# Altium schematic sheet InterfacesB_NONISO232a.SchDoc
size A; DocumentNumber: 4; SheetNumber: 4
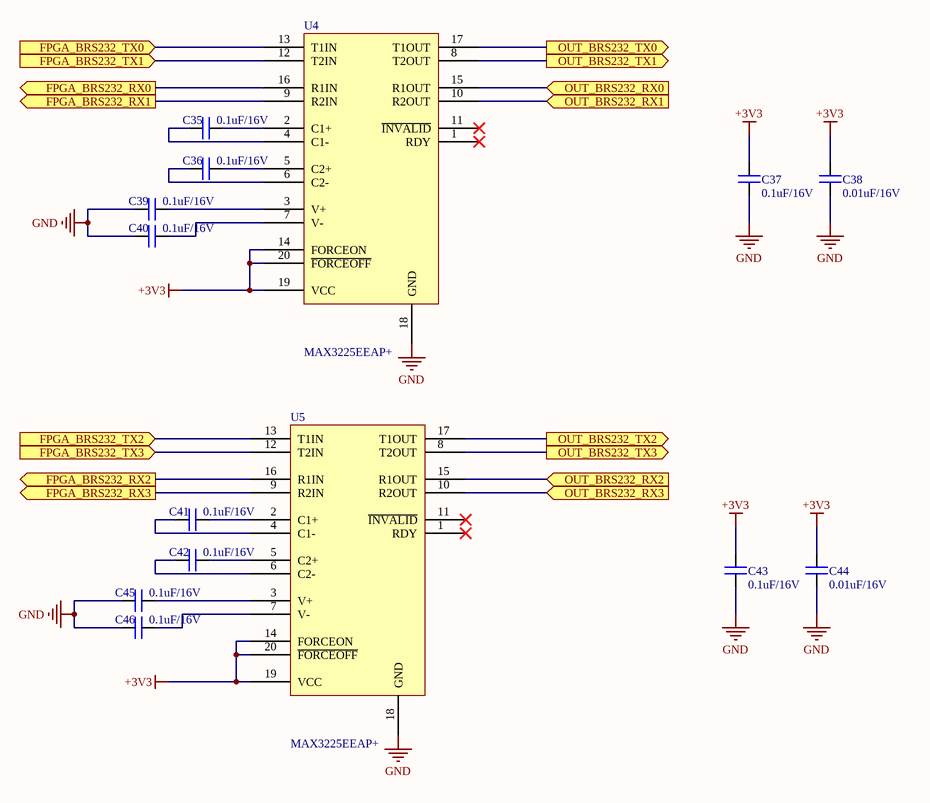
[diagram p0: InterfacesB_NONISO232a.SchDoc]

## Parts
C35  value 0.1uF/16V  [CAP_0805]  (hidden comment: CAP_0805)
C36  value 0.1uF/16V  [CAP_0805]  (hidden comment: CAP_0805)
C37  value 0.1uF/16V  [CAP_0805]  (hidden comment: CAP_0805)
C38  value 0.01uF/16V  [CAP_0805]  (hidden comment: CAP_0805)
C39  value 0.1uF/16V  [CAP_0805]  (hidden comment: CAP_0805)
C40  value 0.1uF/16V  [CAP_0805]  (hidden comment: CAP_0805)
C41  value 0.1uF/16V  [CAP_0805]  (hidden comment: CAP_0805)
C42  value 0.1uF/16V  [CAP_0805]  (hidden comment: CAP_0805)
C43  value 0.1uF/16V  [CAP_0805]  (hidden comment: CAP_0805)
C44  value 0.01uF/16V  [CAP_0805]  (hidden comment: CAP_0805)
C45  value 0.1uF/16V  [CAP_0805]  (hidden comment: CAP_0805)
C46  value 0.1uF/16V  [CAP_0805]  (hidden comment: CAP_0805)
U4  MAX3225EEAP+  [MAX3225EEAP+]
U5  MAX3225EEAP+  [MAX3225EEAP+]

## Ports
FPGA_BRS232_RX0 (out), FPGA_BRS232_RX1 (out), FPGA_BRS232_RX2 (out), FPGA_BRS232_RX3 (out), FPGA_BRS232_TX0 (in), FPGA_BRS232_TX1 (in), FPGA_BRS232_TX2 (in), FPGA_BRS232_TX3 (in), OUT_BRS232_RX0 (in), OUT_BRS232_RX1 (in), OUT_BRS232_RX2 (in), OUT_BRS232_RX3 (in), OUT_BRS232_TX0 (out), OUT_BRS232_TX1 (out), OUT_BRS232_TX2 (out), OUT_BRS232_TX3 (out)

## Nets
+3V3: C37.1 C38.1 C43.1 C44.1 U4.14(FORCEON) U4.19(VCC) U4.20(~{FORCEOFF}) U5.14(FORCEON) U5.19(VCC) U5.20(~{FORCEOFF})
GND: C37.2 C38.2 C39.2 C40.2 C43.2 C44.2 C45.2 C46.2 U4.18(GND) U5.18(GND)
FPGA_BRS232_RX0: U4.16(R1IN) ; port FPGA_BRS232_RX0
FPGA_BRS232_RX1: U4.9(R2IN) ; port FPGA_BRS232_RX1
FPGA_BRS232_RX2: U5.16(R1IN) ; port FPGA_BRS232_RX2
FPGA_BRS232_RX3: U5.9(R2IN) ; port FPGA_BRS232_RX3
FPGA_BRS232_TX0: U4.13(T1IN) ; port FPGA_BRS232_TX0
FPGA_BRS232_TX1: U4.12(T2IN) ; port FPGA_BRS232_TX1
FPGA_BRS232_TX2: U5.13(T1IN) ; port FPGA_BRS232_TX2
FPGA_BRS232_TX3: U5.12(T2IN) ; port FPGA_BRS232_TX3
OUT_BRS232_RX0: U4.15(R1OUT) ; port OUT_BRS232_RX0
OUT_BRS232_RX1: U4.10(R2OUT) ; port OUT_BRS232_RX1
OUT_BRS232_RX2: U5.15(R1OUT) ; port OUT_BRS232_RX2
OUT_BRS232_RX3: U5.10(R2OUT) ; port OUT_BRS232_RX3
OUT_BRS232_TX0: U4.17(T1OUT) ; port OUT_BRS232_TX0
OUT_BRS232_TX1: U4.8(T2OUT) ; port OUT_BRS232_TX1
OUT_BRS232_TX2: U5.17(T1OUT) ; port OUT_BRS232_TX2
OUT_BRS232_TX3: U5.8(T2OUT) ; port OUT_BRS232_TX3
NetC35_1: C35.1 U4.2(C1+)
NetC35_2: C35.2 U4.4(C1-)
NetC36_1: C36.1 U4.5(C2+)
NetC36_2: C36.2 U4.6(C2-)
NetC39_1: C39.1 U4.3(V+)
NetC40_1: C40.1 U4.7(V-)
NetC41_1: C41.1 U5.2(C1+)
NetC41_2: C41.2 U5.4(C1-)
NetC42_1: C42.1 U5.5(C2+)
NetC42_2: C42.2 U5.6(C2-)
NetC45_1: C45.1 U5.3(V+)
NetC46_1: C46.1 U5.7(V-)

Not connected (* = marked no-connect by the designer): U4 1(RDY)* 11(~{INVALID})*; U5 1(RDY)* 11(~{INVALID})*

## Library data of the parts
U4 U5 = MAX3225EEAP+: Supplier 1: Digi-Key; Supplier Part Number 1: MAX3225EEAP+-ND